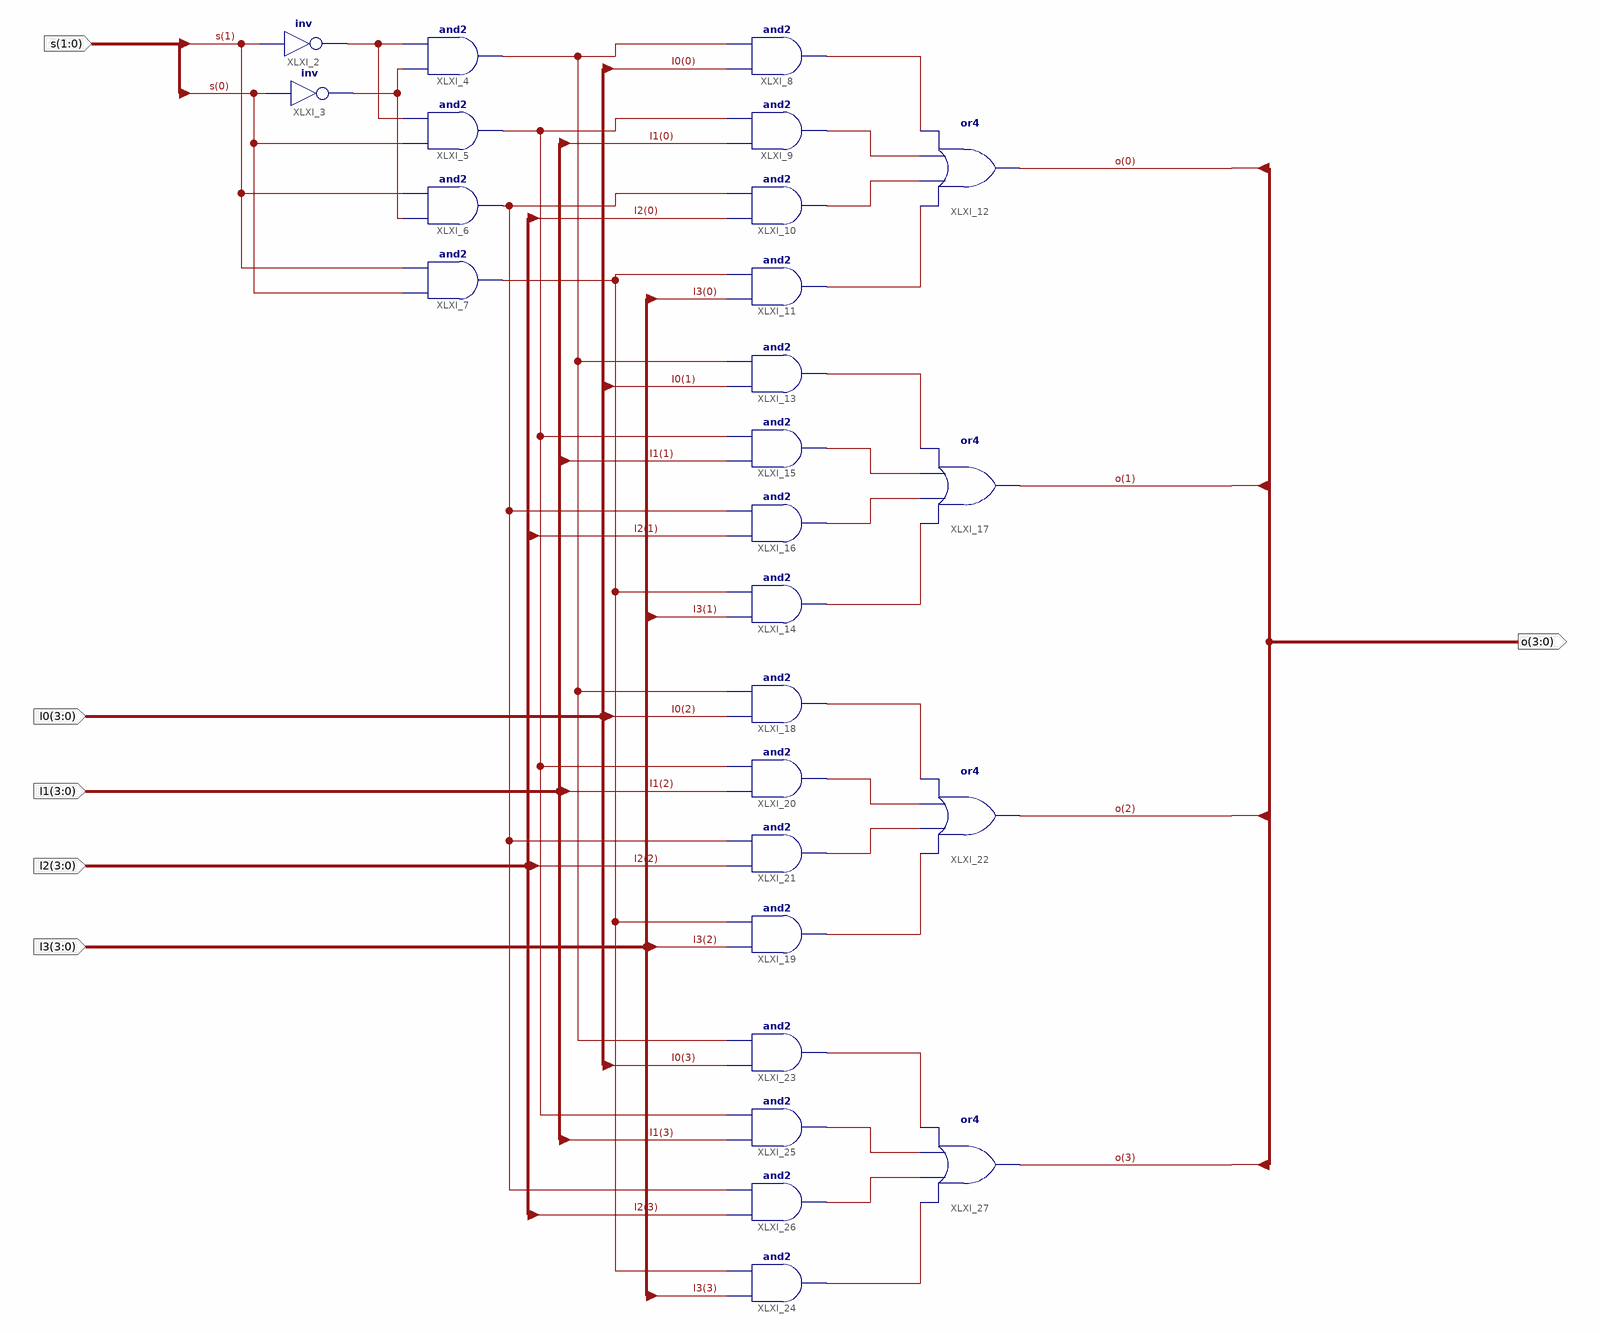
[diagram p0: schematic sheet 1]
// Xilinx ISE schematic MUX4T1_4.sch (kintex7) as structural Verilog: 26 symbols, 6 ports
module MUX4T1_4 (
  input  [1:0] s,
  input  [3:0] I2,
  input  [3:0] I1,
  input  [3:0] I0,
  input  [3:0] I3,
  output [3:0] o
);

  wire XLXN_5, XLXN_6, XLXN_16, XLXN_17, XLXN_18, XLXN_19, XLXN_20, XLXN_21, XLXN_22, XLXN_23, XLXN_24,
       XLXN_25, XLXN_27, XLXN_28, XLXN_29, XLXN_41, XLXN_42, XLXN_43, XLXN_69, XLXN_74, XLXN_78, XLXN_81;

  and XLXI_4 (XLXN_74, XLXN_5, XLXN_6);
  and XLXI_5 (XLXN_78, s[0], XLXN_6);
  and XLXI_6 (XLXN_81, XLXN_5, s[1]);
  and XLXI_7 (XLXN_69, s[0], s[1]);
  not XLXI_2 (XLXN_6, s[1]);
  not XLXI_3 (XLXN_5, s[0]);
  and XLXI_11 (XLXN_41, I3[0], XLXN_69);
  and XLXI_14 (XLXN_20, I3[1], XLXN_69);
  and XLXI_15 (XLXN_18, I1[1], XLXN_78);
  and XLXI_16 (XLXN_19, I2[1], XLXN_81);
  or XLXI_17 (o[1], XLXN_20, XLXN_19, XLXN_18, XLXN_17);
  and XLXI_13 (XLXN_17, I0[1], XLXN_74);
  and XLXI_18 (XLXN_21, I0[2], XLXN_74);
  and XLXI_19 (XLXN_24, I3[2], XLXN_69);
  and XLXI_20 (XLXN_22, I1[2], XLXN_78);
  and XLXI_21 (XLXN_23, I2[2], XLXN_81);
  or XLXI_22 (o[2], XLXN_24, XLXN_23, XLXN_22, XLXN_21);
  and XLXI_23 (XLXN_25, I0[3], XLXN_74);
  and XLXI_24 (XLXN_28, I3[3], XLXN_69);
  and XLXI_25 (XLXN_29, I1[3], XLXN_78);
  and XLXI_26 (XLXN_27, I2[3], XLXN_81);
  or XLXI_27 (o[3], XLXN_28, XLXN_27, XLXN_29, XLXN_25);
  or XLXI_12 (o[0], XLXN_41, XLXN_42, XLXN_43, XLXN_16);
  and XLXI_10 (XLXN_42, I2[0], XLXN_81);
  and XLXI_9 (XLXN_43, I1[0], XLXN_78);
  and XLXI_8 (XLXN_16, I0[0], XLXN_74);
endmodule
